# Altium project BTF16_2.PrjPcb (part 2 of 2)

## Sheet ASIC_3.SchDoc: Title
size A2; Date: Date; CompanyName: Integrated Micro-Electronics Bulgaria; Organization: Design & Development Department; Address1: Drawing Type; Address2: Address 1; Address3: Address 2; Address4: Address 3; DocumentNumber: 730xxx; Revision: 01; SheetNumber: 1; SheetTotal: 1; PageSetup: Record=PageOptions|CenterHorizontal=True|CenterVertical=True|PrintScale=0.70|XCorrection=1.00|YCorrection=1.00|PrintKind=2|BorderSize=5000000|LeftOffset=0|BottomOffset=0|Orientation=2|PaperLength=1000|PaperWidth=1000|Scale=100|PaperSource=7|PrintQuality=-4|MediaType=1|DitherType=10|PaperKind=A4|PrintScaleMode=1; SheetSize: A3; Time: Time; ModifiedDate: Mod. Date
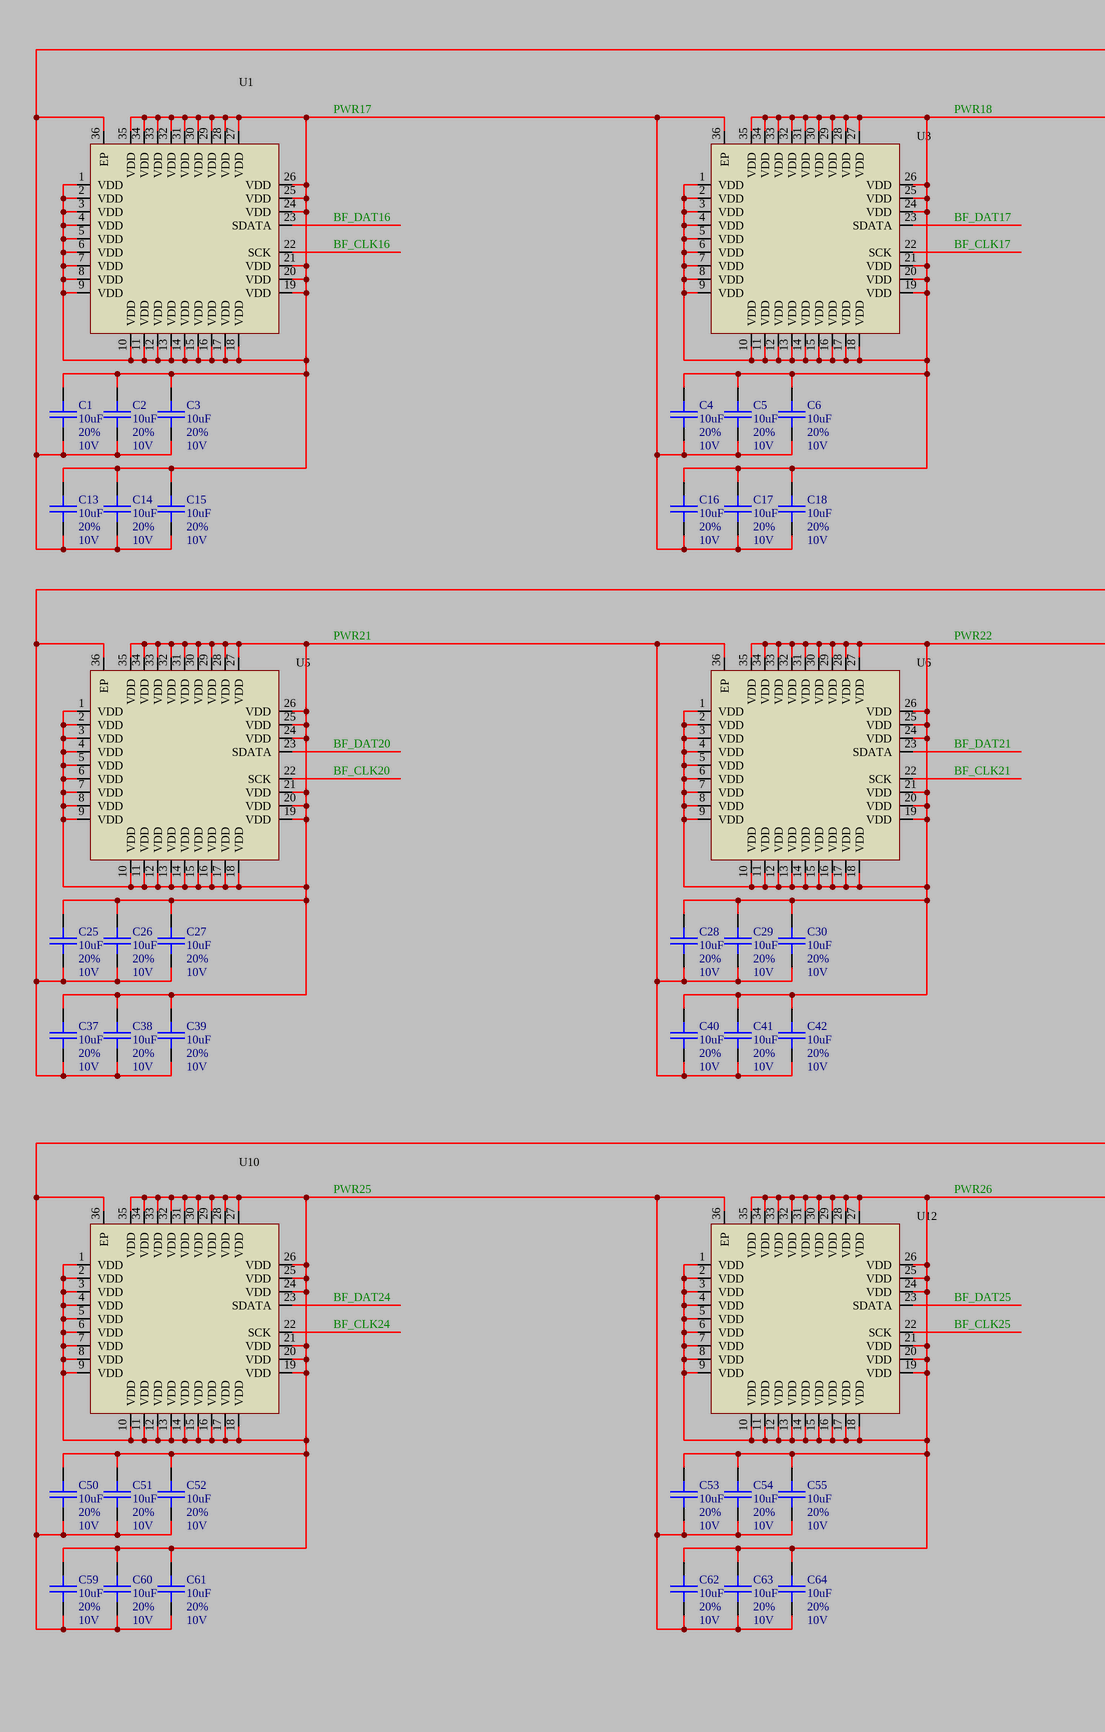
[diagram p6: ASIC_3.SchDoc, left]
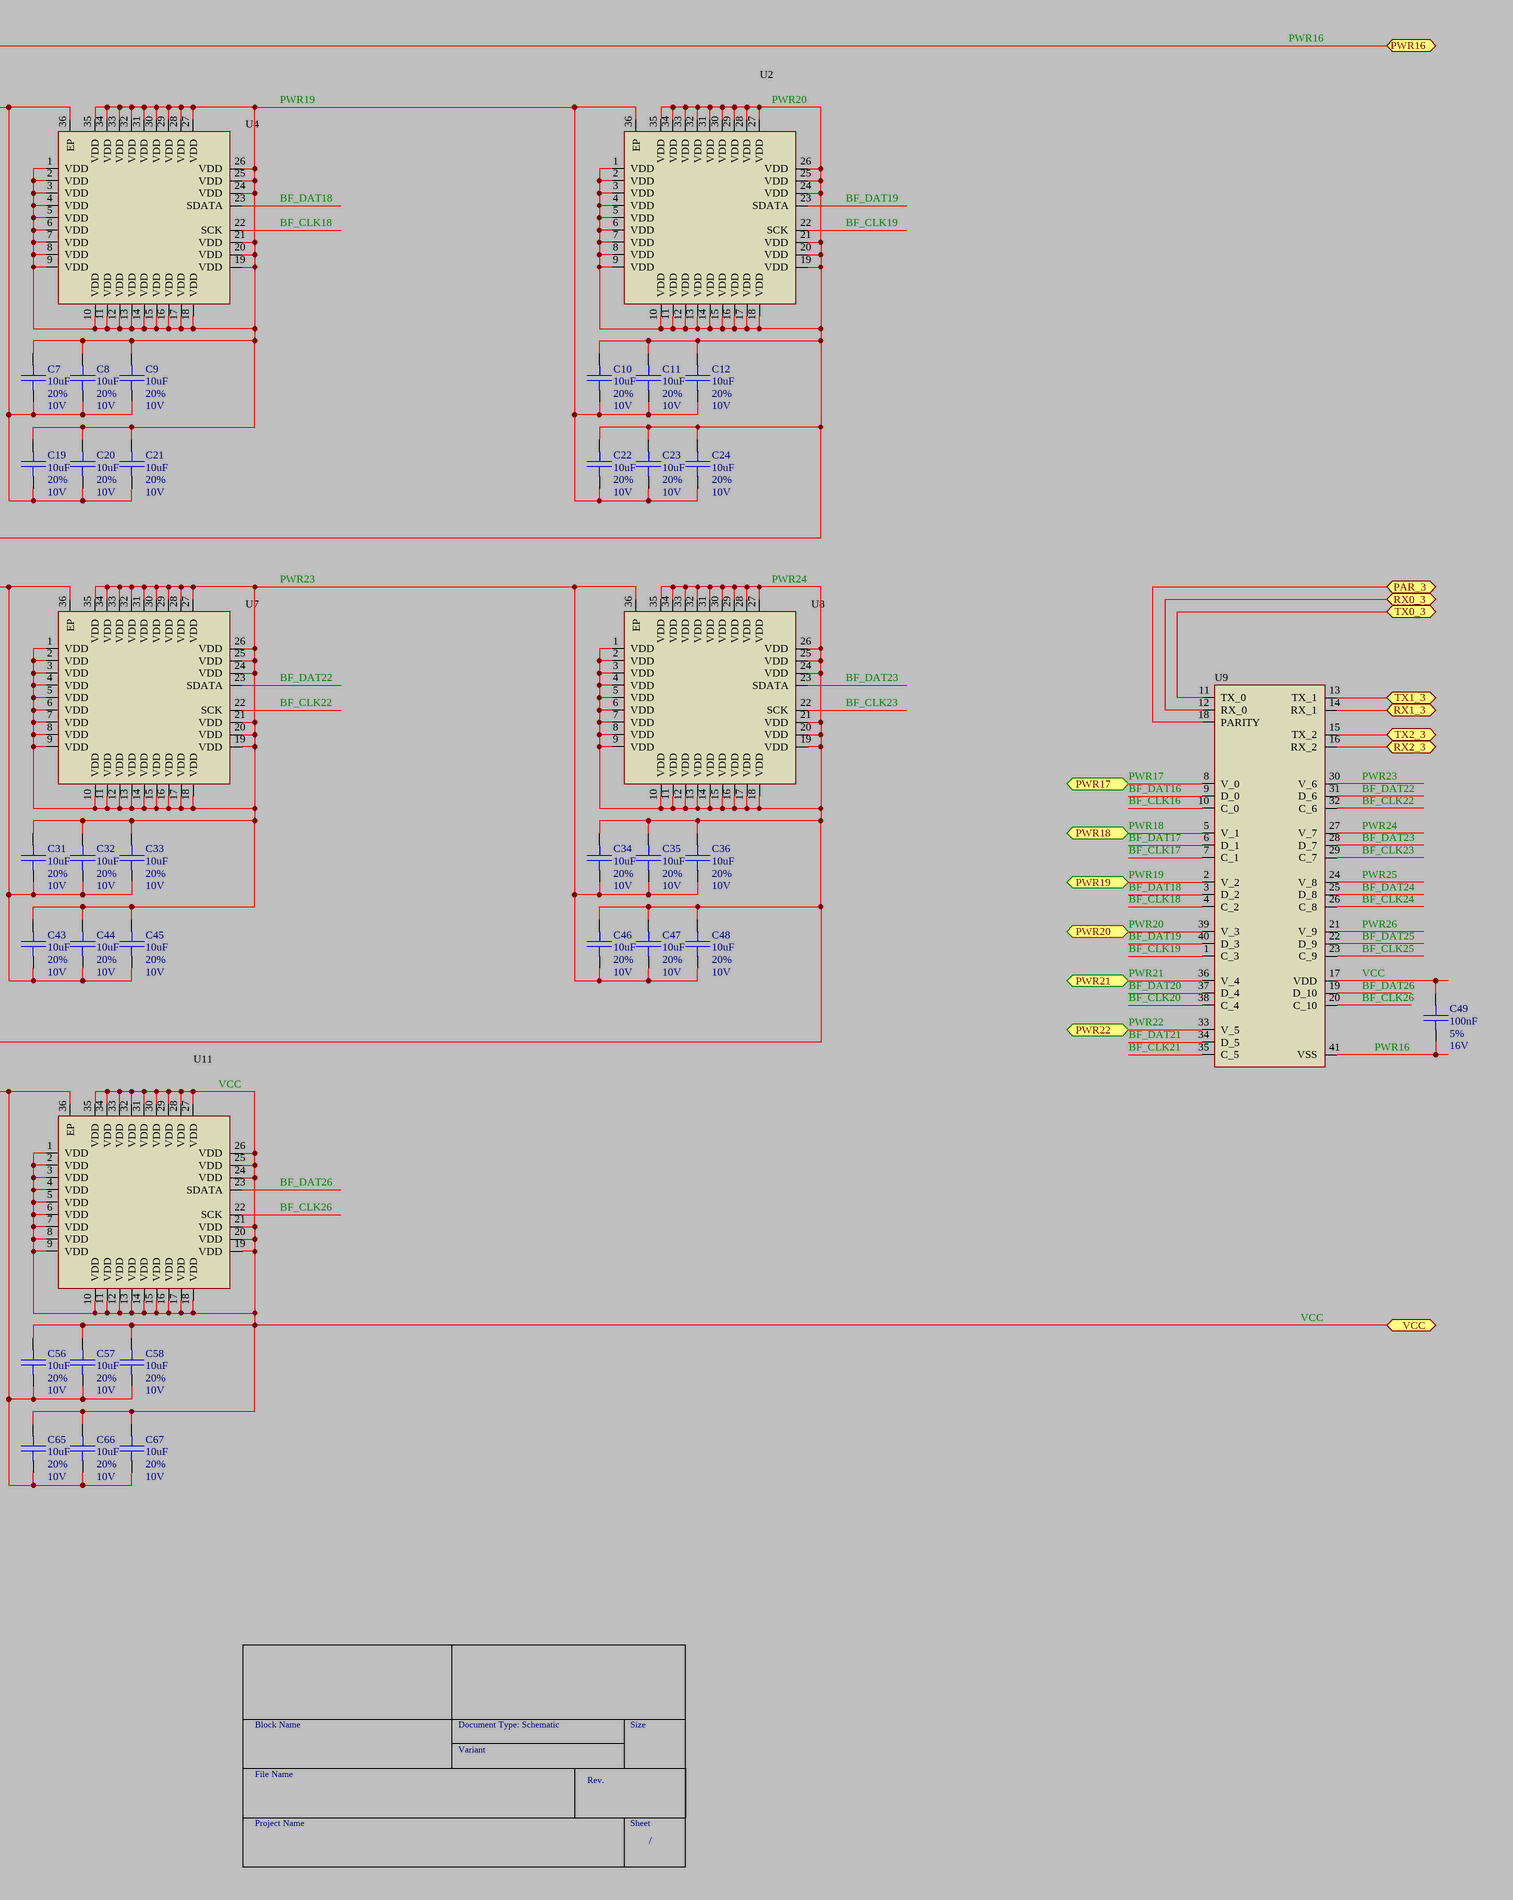
[diagram p7: ASIC_3.SchDoc, right]

### Parts
C1  DB_VALUE: 10uF  DB_TOLERANCE: 20%  DB_VOLTAGE: 10V  [SMD_0402_CAPC1005X70N]  (hidden comment: C)
C2  DB_VALUE: 10uF  DB_TOLERANCE: 20%  DB_VOLTAGE: 10V  [SMD_0402_CAPC1005X70N]  (hidden comment: C)
C3  DB_VALUE: 10uF  DB_TOLERANCE: 20%  DB_VOLTAGE: 10V  [SMD_0402_CAPC1005X70N]  (hidden comment: C)
C4  DB_VALUE: 10uF  DB_TOLERANCE: 20%  DB_VOLTAGE: 10V  [SMD_0402_CAPC1005X70N]  (hidden comment: C)
C5  DB_VALUE: 10uF  DB_TOLERANCE: 20%  DB_VOLTAGE: 10V  [SMD_0402_CAPC1005X70N]  (hidden comment: C)
C6  DB_VALUE: 10uF  DB_TOLERANCE: 20%  DB_VOLTAGE: 10V  [SMD_0402_CAPC1005X70N]  (hidden comment: C)
C7  DB_VALUE: 10uF  DB_TOLERANCE: 20%  DB_VOLTAGE: 10V  [SMD_0402_CAPC1005X70N]  (hidden comment: C)
C8  DB_VALUE: 10uF  DB_TOLERANCE: 20%  DB_VOLTAGE: 10V  [SMD_0402_CAPC1005X70N]  (hidden comment: C)
C9  DB_VALUE: 10uF  DB_TOLERANCE: 20%  DB_VOLTAGE: 10V  [SMD_0402_CAPC1005X70N]  (hidden comment: C)
C10  DB_VALUE: 10uF  DB_TOLERANCE: 20%  DB_VOLTAGE: 10V  [SMD_0402_CAPC1005X70N]  (hidden comment: C)
C11  DB_VALUE: 10uF  DB_TOLERANCE: 20%  DB_VOLTAGE: 10V  [SMD_0402_CAPC1005X70N]  (hidden comment: C)
C12  DB_VALUE: 10uF  DB_TOLERANCE: 20%  DB_VOLTAGE: 10V  [SMD_0402_CAPC1005X70N]  (hidden comment: C)
C13  DB_VALUE: 10uF  DB_TOLERANCE: 20%  DB_VOLTAGE: 10V  [SMD_0402_CAPC1005X70N]  (hidden comment: C)
C14  DB_VALUE: 10uF  DB_TOLERANCE: 20%  DB_VOLTAGE: 10V  [SMD_0402_CAPC1005X70N]  (hidden comment: C)
C15  DB_VALUE: 10uF  DB_TOLERANCE: 20%  DB_VOLTAGE: 10V  [SMD_0402_CAPC1005X70N]  (hidden comment: C)
C16  DB_VALUE: 10uF  DB_TOLERANCE: 20%  DB_VOLTAGE: 10V  [SMD_0402_CAPC1005X70N]  (hidden comment: C)
C17  DB_VALUE: 10uF  DB_TOLERANCE: 20%  DB_VOLTAGE: 10V  [SMD_0402_CAPC1005X70N]  (hidden comment: C)
C18  DB_VALUE: 10uF  DB_TOLERANCE: 20%  DB_VOLTAGE: 10V  [SMD_0402_CAPC1005X70N]  (hidden comment: C)
C19  DB_VALUE: 10uF  DB_TOLERANCE: 20%  DB_VOLTAGE: 10V  [SMD_0402_CAPC1005X70N]  (hidden comment: C)
C20  DB_VALUE: 10uF  DB_TOLERANCE: 20%  DB_VOLTAGE: 10V  [SMD_0402_CAPC1005X70N]  (hidden comment: C)
C21  DB_VALUE: 10uF  DB_TOLERANCE: 20%  DB_VOLTAGE: 10V  [SMD_0402_CAPC1005X70N]  (hidden comment: C)
C22  DB_VALUE: 10uF  DB_TOLERANCE: 20%  DB_VOLTAGE: 10V  [SMD_0402_CAPC1005X70N]  (hidden comment: C)
C23  DB_VALUE: 10uF  DB_TOLERANCE: 20%  DB_VOLTAGE: 10V  [SMD_0402_CAPC1005X70N]  (hidden comment: C)
C24  DB_VALUE: 10uF  DB_TOLERANCE: 20%  DB_VOLTAGE: 10V  [SMD_0402_CAPC1005X70N]  (hidden comment: C)
C25  DB_VALUE: 10uF  DB_TOLERANCE: 20%  DB_VOLTAGE: 10V  [SMD_0402_CAPC1005X70N]  (hidden comment: C)
C26  DB_VALUE: 10uF  DB_TOLERANCE: 20%  DB_VOLTAGE: 10V  [SMD_0402_CAPC1005X70N]  (hidden comment: C)
C27  DB_VALUE: 10uF  DB_TOLERANCE: 20%  DB_VOLTAGE: 10V  [SMD_0402_CAPC1005X70N]  (hidden comment: C)
C28  DB_VALUE: 10uF  DB_TOLERANCE: 20%  DB_VOLTAGE: 10V  [SMD_0402_CAPC1005X70N]  (hidden comment: C)
C29  DB_VALUE: 10uF  DB_TOLERANCE: 20%  DB_VOLTAGE: 10V  [SMD_0402_CAPC1005X70N]  (hidden comment: C)
C30  DB_VALUE: 10uF  DB_TOLERANCE: 20%  DB_VOLTAGE: 10V  [SMD_0402_CAPC1005X70N]  (hidden comment: C)
C31  DB_VALUE: 10uF  DB_TOLERANCE: 20%  DB_VOLTAGE: 10V  [SMD_0402_CAPC1005X70N]  (hidden comment: C)
C32  DB_VALUE: 10uF  DB_TOLERANCE: 20%  DB_VOLTAGE: 10V  [SMD_0402_CAPC1005X70N]  (hidden comment: C)
C33  DB_VALUE: 10uF  DB_TOLERANCE: 20%  DB_VOLTAGE: 10V  [SMD_0402_CAPC1005X70N]  (hidden comment: C)
C34  DB_VALUE: 10uF  DB_TOLERANCE: 20%  DB_VOLTAGE: 10V  [SMD_0402_CAPC1005X70N]  (hidden comment: C)
C35  DB_VALUE: 10uF  DB_TOLERANCE: 20%  DB_VOLTAGE: 10V  [SMD_0402_CAPC1005X70N]  (hidden comment: C)
C36  DB_VALUE: 10uF  DB_TOLERANCE: 20%  DB_VOLTAGE: 10V  [SMD_0402_CAPC1005X70N]  (hidden comment: C)
C37  DB_VALUE: 10uF  DB_TOLERANCE: 20%  DB_VOLTAGE: 10V  [SMD_0402_CAPC1005X70N]  (hidden comment: C)
C38  DB_VALUE: 10uF  DB_TOLERANCE: 20%  DB_VOLTAGE: 10V  [SMD_0402_CAPC1005X70N]  (hidden comment: C)
C39  DB_VALUE: 10uF  DB_TOLERANCE: 20%  DB_VOLTAGE: 10V  [SMD_0402_CAPC1005X70N]  (hidden comment: C)
C40  DB_VALUE: 10uF  DB_TOLERANCE: 20%  DB_VOLTAGE: 10V  [SMD_0402_CAPC1005X70N]  (hidden comment: C)
C41  DB_VALUE: 10uF  DB_TOLERANCE: 20%  DB_VOLTAGE: 10V  [SMD_0402_CAPC1005X70N]  (hidden comment: C)
C42  DB_VALUE: 10uF  DB_TOLERANCE: 20%  DB_VOLTAGE: 10V  [SMD_0402_CAPC1005X70N]  (hidden comment: C)
C43  DB_VALUE: 10uF  DB_TOLERANCE: 20%  DB_VOLTAGE: 10V  [SMD_0402_CAPC1005X70N]  (hidden comment: C)
C44  DB_VALUE: 10uF  DB_TOLERANCE: 20%  DB_VOLTAGE: 10V  [SMD_0402_CAPC1005X70N]  (hidden comment: C)
C45  DB_VALUE: 10uF  DB_TOLERANCE: 20%  DB_VOLTAGE: 10V  [SMD_0402_CAPC1005X70N]  (hidden comment: C)
C46  DB_VALUE: 10uF  DB_TOLERANCE: 20%  DB_VOLTAGE: 10V  [SMD_0402_CAPC1005X70N]  (hidden comment: C)
C47  DB_VALUE: 10uF  DB_TOLERANCE: 20%  DB_VOLTAGE: 10V  [SMD_0402_CAPC1005X70N]  (hidden comment: C)
C48  DB_VALUE: 10uF  DB_TOLERANCE: 20%  DB_VOLTAGE: 10V  [SMD_0402_CAPC1005X70N]  (hidden comment: C)
C49  DB_VALUE: 100nF  DB_TOLERANCE: 5%  DB_VOLTAGE: 16V  [SMD_0603_CAPC1608X95N]  (hidden comment: C)
C50  DB_VALUE: 10uF  DB_TOLERANCE: 20%  DB_VOLTAGE: 10V  [SMD_0402_CAPC1005X70N]  (hidden comment: C)
C51  DB_VALUE: 10uF  DB_TOLERANCE: 20%  DB_VOLTAGE: 10V  [SMD_0402_CAPC1005X70N]  (hidden comment: C)
C52  DB_VALUE: 10uF  DB_TOLERANCE: 20%  DB_VOLTAGE: 10V  [SMD_0402_CAPC1005X70N]  (hidden comment: C)
C53  DB_VALUE: 10uF  DB_TOLERANCE: 20%  DB_VOLTAGE: 10V  [SMD_0402_CAPC1005X70N]  (hidden comment: C)
C54  DB_VALUE: 10uF  DB_TOLERANCE: 20%  DB_VOLTAGE: 10V  [SMD_0402_CAPC1005X70N]  (hidden comment: C)
C55  DB_VALUE: 10uF  DB_TOLERANCE: 20%  DB_VOLTAGE: 10V  [SMD_0402_CAPC1005X70N]  (hidden comment: C)
C56  DB_VALUE: 10uF  DB_TOLERANCE: 20%  DB_VOLTAGE: 10V  [SMD_0402_CAPC1005X70N]  (hidden comment: C)
C57  DB_VALUE: 10uF  DB_TOLERANCE: 20%  DB_VOLTAGE: 10V  [SMD_0402_CAPC1005X70N]  (hidden comment: C)
C58  DB_VALUE: 10uF  DB_TOLERANCE: 20%  DB_VOLTAGE: 10V  [SMD_0402_CAPC1005X70N]  (hidden comment: C)
C59  DB_VALUE: 10uF  DB_TOLERANCE: 20%  DB_VOLTAGE: 10V  [SMD_0402_CAPC1005X70N]  (hidden comment: C)
C60  DB_VALUE: 10uF  DB_TOLERANCE: 20%  DB_VOLTAGE: 10V  [SMD_0402_CAPC1005X70N]  (hidden comment: C)
C61  DB_VALUE: 10uF  DB_TOLERANCE: 20%  DB_VOLTAGE: 10V  [SMD_0402_CAPC1005X70N]  (hidden comment: C)
C62  DB_VALUE: 10uF  DB_TOLERANCE: 20%  DB_VOLTAGE: 10V  [SMD_0402_CAPC1005X70N]  (hidden comment: C)
C63  DB_VALUE: 10uF  DB_TOLERANCE: 20%  DB_VOLTAGE: 10V  [SMD_0402_CAPC1005X70N]  (hidden comment: C)
C64  DB_VALUE: 10uF  DB_TOLERANCE: 20%  DB_VOLTAGE: 10V  [SMD_0402_CAPC1005X70N]  (hidden comment: C)
C65  DB_VALUE: 10uF  DB_TOLERANCE: 20%  DB_VOLTAGE: 10V  [SMD_0402_CAPC1005X70N]  (hidden comment: C)
C66  DB_VALUE: 10uF  DB_TOLERANCE: 20%  DB_VOLTAGE: 10V  [SMD_0402_CAPC1005X70N]  (hidden comment: C)
C67  DB_VALUE: 10uF  DB_TOLERANCE: 20%  DB_VOLTAGE: 10V  [SMD_0402_CAPC1005X70N]  (hidden comment: C)
U1  IC_BITFURY16  [SMD_QFN50P600X600X175-36AN]  (value not drawn)
U2  IC_BITFURY16  [SMD_QFN50P600X600X175-36AN]  (value not drawn)
U3  IC_BITFURY16  [SMD_QFN50P600X600X175-36AN]  (value not drawn)
U4  IC_BITFURY16  [SMD_QFN50P600X600X175-36AN]  (value not drawn)
U5  IC_BITFURY16  [SMD_QFN50P600X600X175-36AN]  (value not drawn)
U6  IC_BITFURY16  [SMD_QFN50P600X600X175-36AN]  (value not drawn)
U7  IC_BITFURY16  [SMD_QFN50P600X600X175-36AN]  (value not drawn)
U8  IC_BITFURY16  [SMD_QFN50P600X600X175-36AN]  (value not drawn)
U9  IC_BTC250  [SMD_QFN40P500X500X80-41N]  (value not drawn)
U10  IC_BITFURY16  [SMD_QFN50P600X600X175-36AN]  (value not drawn)
U11  IC_BITFURY16  [SMD_QFN50P600X600X175-36AN]  (value not drawn)
U12  IC_BITFURY16  [SMD_QFN50P600X600X175-36AN]  (value not drawn)

### Ports
PAR_3, PWR16, PWR17, PWR18, PWR19, PWR20, PWR21, PWR22, RX0_3, RX1_3, RX2_3, TX0_3, TX1_3, TX2_3, VCC

### Nets
BF_CLK16: U1.22(SCK) U9.10(C_0)
BF_CLK17: U3.22(SCK) U9.7(C_1)
BF_CLK18: U4.22(SCK) U9.4(C_2)
BF_CLK19: U2.22(SCK) U9.1(C_3)
BF_CLK20: U5.22(SCK) U9.38(C_4)
BF_CLK21: U6.22(SCK) U9.35(C_5)
BF_CLK22: U7.22(SCK) U9.32(C_6)
BF_CLK23: U8.22(SCK) U9.29(C_7)
BF_CLK24: U9.26(C_8) U10.22(SCK)
BF_CLK25: U9.23(C_9) U12.22(SCK)
BF_CLK26: U9.20(C_10) U11.22(SCK)
BF_DAT16: U1.23(SDATA) U9.9(D_0)
BF_DAT17: U3.23(SDATA) U9.6(D_1)
BF_DAT18: U4.23(SDATA) U9.3(D_2)
BF_DAT19: U2.23(SDATA) U9.40(D_3)
BF_DAT20: U5.23(SDATA) U9.37(D_4)
BF_DAT21: U6.23(SDATA) U9.34(D_5)
BF_DAT22: U7.23(SDATA) U9.31(D_6)
BF_DAT23: U8.23(SDATA) U9.28(D_7)
BF_DAT24: U9.25(D_8) U10.23(SDATA)
BF_DAT25: U9.22(D_9) U12.23(SDATA)
BF_DAT26: U9.19(D_10) U11.23(SDATA)
PAR_3: U9.18(PARITY) ; port PAR_3
PWR16: C1.2 C2.2 C3.2 C13.2 C14.2 C15.2 C49.2 U1.36(EP) U9.41(VSS) ; port PWR16
PWR17: C1.1 C2.1 C3.1 C4.2 C5.2 C6.2 C13.1 C14.1 C15.1 C16.2 C17.2 C18.2 U1.1(VDD) U1.2(VDD) U1.3(VDD) U1.4(VDD) U1.5(VDD) U1.6(VDD) U1.7(VDD) U1.8(VDD) U1.9(VDD) U1.10(VDD) U1.11(VDD) U1.12(VDD) U1.13(VDD) U1.14(VDD) U1.15(VDD) U1.16(VDD) U1.17(VDD) U1.18(VDD) U1.19(VDD) U1.20(VDD) U1.21(VDD) U1.24(VDD) U1.25(VDD) U1.26(VDD) U1.27(VDD) U1.28(VDD) U1.29(VDD) U1.30(VDD) U1.31(VDD) U1.32(VDD) U1.33(VDD) U1.34(VDD) U1.35(VDD) U3.36(EP) U9.8(V_0) ; port PWR17
PWR18: C4.1 C5.1 C6.1 C7.2 C8.2 C9.2 C16.1 C17.1 C18.1 C19.2 C20.2 C21.2 U3.1(VDD) U3.2(VDD) U3.3(VDD) U3.4(VDD) U3.5(VDD) U3.6(VDD) U3.7(VDD) U3.8(VDD) U3.9(VDD) U3.10(VDD) U3.11(VDD) U3.12(VDD) U3.13(VDD) U3.14(VDD) U3.15(VDD) U3.16(VDD) U3.17(VDD) U3.18(VDD) U3.19(VDD) U3.20(VDD) U3.21(VDD) U3.24(VDD) U3.25(VDD) U3.26(VDD) U3.27(VDD) U3.28(VDD) U3.29(VDD) U3.30(VDD) U3.31(VDD) U3.32(VDD) U3.33(VDD) U3.34(VDD) U3.35(VDD) U4.36(EP) U9.5(V_1) ; port PWR18
PWR19: C7.1 C8.1 C9.1 C10.2 C11.2 C12.2 C19.1 C20.1 C21.1 C22.2 C23.2 C24.2 U2.36(EP) U4.1(VDD) U4.2(VDD) U4.3(VDD) U4.4(VDD) U4.5(VDD) U4.6(VDD) U4.7(VDD) U4.8(VDD) U4.9(VDD) U4.10(VDD) U4.11(VDD) U4.12(VDD) U4.13(VDD) U4.14(VDD) U4.15(VDD) U4.16(VDD) U4.17(VDD) U4.18(VDD) U4.19(VDD) U4.20(VDD) U4.21(VDD) U4.24(VDD) U4.25(VDD) U4.26(VDD) U4.27(VDD) U4.28(VDD) U4.29(VDD) U4.30(VDD) U4.31(VDD) U4.32(VDD) U4.33(VDD) U4.34(VDD) U4.35(VDD) U9.2(V_2) ; port PWR19
PWR20: C10.1 C11.1 C12.1 C22.1 C23.1 C24.1 C25.2 C26.2 C27.2 C37.2 C38.2 C39.2 U2.1(VDD) U2.2(VDD) U2.3(VDD) U2.4(VDD) U2.5(VDD) U2.6(VDD) U2.7(VDD) U2.8(VDD) U2.9(VDD) U2.10(VDD) U2.11(VDD) U2.12(VDD) U2.13(VDD) U2.14(VDD) U2.15(VDD) U2.16(VDD) U2.17(VDD) U2.18(VDD) U2.19(VDD) U2.20(VDD) U2.21(VDD) U2.24(VDD) U2.25(VDD) U2.26(VDD) U2.27(VDD) U2.28(VDD) U2.29(VDD) U2.30(VDD) U2.31(VDD) U2.32(VDD) U2.33(VDD) U2.34(VDD) U2.35(VDD) U5.36(EP) U9.39(V_3) ; port PWR20
PWR21: C25.1 C26.1 C27.1 C28.2 C29.2 C30.2 C37.1 C38.1 C39.1 C40.2 C41.2 C42.2 U5.1(VDD) U5.2(VDD) U5.3(VDD) U5.4(VDD) U5.5(VDD) U5.6(VDD) U5.7(VDD) U5.8(VDD) U5.9(VDD) U5.10(VDD) U5.11(VDD) U5.12(VDD) U5.13(VDD) U5.14(VDD) U5.15(VDD) U5.16(VDD) U5.17(VDD) U5.18(VDD) U5.19(VDD) U5.20(VDD) U5.21(VDD) U5.24(VDD) U5.25(VDD) U5.26(VDD) U5.27(VDD) U5.28(VDD) U5.29(VDD) U5.30(VDD) U5.31(VDD) U5.32(VDD) U5.33(VDD) U5.34(VDD) U5.35(VDD) U6.36(EP) U9.36(V_4) ; port PWR21
PWR22: C28.1 C29.1 C30.1 C31.2 C32.2 C33.2 C40.1 C41.1 C42.1 C43.2 C44.2 C45.2 U6.1(VDD) U6.2(VDD) U6.3(VDD) U6.4(VDD) U6.5(VDD) U6.6(VDD) U6.7(VDD) U6.8(VDD) U6.9(VDD) U6.10(VDD) U6.11(VDD) U6.12(VDD) U6.13(VDD) U6.14(VDD) U6.15(VDD) U6.16(VDD) U6.17(VDD) U6.18(VDD) U6.19(VDD) U6.20(VDD) U6.21(VDD) U6.24(VDD) U6.25(VDD) U6.26(VDD) U6.27(VDD) U6.28(VDD) U6.29(VDD) U6.30(VDD) U6.31(VDD) U6.32(VDD) U6.33(VDD) U6.34(VDD) U6.35(VDD) U7.36(EP) U9.33(V_5) ; port PWR22
PWR23: C31.1 C32.1 C33.1 C34.2 C35.2 C36.2 C43.1 C44.1 C45.1 C46.2 C47.2 C48.2 U7.1(VDD) U7.2(VDD) U7.3(VDD) U7.4(VDD) U7.5(VDD) U7.6(VDD) U7.7(VDD) U7.8(VDD) U7.9(VDD) U7.10(VDD) U7.11(VDD) U7.12(VDD) U7.13(VDD) U7.14(VDD) U7.15(VDD) U7.16(VDD) U7.17(VDD) U7.18(VDD) U7.19(VDD) U7.20(VDD) U7.21(VDD) U7.24(VDD) U7.25(VDD) U7.26(VDD) U7.27(VDD) U7.28(VDD) U7.29(VDD) U7.30(VDD) U7.31(VDD) U7.32(VDD) U7.33(VDD) U7.34(VDD) U7.35(VDD) U8.36(EP) U9.30(V_6)
PWR24: C34.1 C35.1 C36.1 C46.1 C47.1 C48.1 C50.2 C51.2 C52.2 C59.2 C60.2 C61.2 U8.1(VDD) U8.2(VDD) U8.3(VDD) U8.4(VDD) U8.5(VDD) U8.6(VDD) U8.7(VDD) U8.8(VDD) U8.9(VDD) U8.10(VDD) U8.11(VDD) U8.12(VDD) U8.13(VDD) U8.14(VDD) U8.15(VDD) U8.16(VDD) U8.17(VDD) U8.18(VDD) U8.19(VDD) U8.20(VDD) U8.21(VDD) U8.24(VDD) U8.25(VDD) U8.26(VDD) U8.27(VDD) U8.28(VDD) U8.29(VDD) U8.30(VDD) U8.31(VDD) U8.32(VDD) U8.33(VDD) U8.34(VDD) U8.35(VDD) U9.27(V_7) U10.36(EP)
PWR25: C50.1 C51.1 C52.1 C53.2 C54.2 C55.2 C59.1 C60.1 C61.1 C62.2 C63.2 C64.2 U9.24(V_8) U10.1(VDD) U10.2(VDD) U10.3(VDD) U10.4(VDD) U10.5(VDD) U10.6(VDD) U10.7(VDD) U10.8(VDD) U10.9(VDD) U10.10(VDD) U10.11(VDD) U10.12(VDD) U10.13(VDD) U10.14(VDD) U10.15(VDD) U10.16(VDD) U10.17(VDD) U10.18(VDD) U10.19(VDD) U10.20(VDD) U10.21(VDD) U10.24(VDD) U10.25(VDD) U10.26(VDD) U10.27(VDD) U10.28(VDD) U10.29(VDD) U10.30(VDD) U10.31(VDD) U10.32(VDD) U10.33(VDD) U10.34(VDD) U10.35(VDD) U12.36(EP)
PWR26: C53.1 C54.1 C55.1 C56.2 C57.2 C58.2 C62.1 C63.1 C64.1 C65.2 C66.2 C67.2 U9.21(V_9) U11.36(EP) U12.1(VDD) U12.2(VDD) U12.3(VDD) U12.4(VDD) U12.5(VDD) U12.6(VDD) U12.7(VDD) U12.8(VDD) U12.9(VDD) U12.10(VDD) U12.11(VDD) U12.12(VDD) U12.13(VDD) U12.14(VDD) U12.15(VDD) U12.16(VDD) U12.17(VDD) U12.18(VDD) U12.19(VDD) U12.20(VDD) U12.21(VDD) U12.24(VDD) U12.25(VDD) U12.26(VDD) U12.27(VDD) U12.28(VDD) U12.29(VDD) U12.30(VDD) U12.31(VDD) U12.32(VDD) U12.33(VDD) U12.34(VDD) U12.35(VDD)
RX0_3: U9.12(RX_0) ; port RX0_3
RX1_3: U9.14(RX_1) ; port RX1_3
RX2_3: U9.16(RX_2) ; port RX2_3
TX0_3: U9.11(TX_0) ; port TX0_3
TX1_3: U9.13(TX_1) ; port TX1_3
TX2_3: U9.15(TX_2) ; port TX2_3
VCC: C49.1 C56.1 C57.1 C58.1 C65.1 C66.1 C67.1 U9.17(VDD) U11.1(VDD) U11.2(VDD) U11.3(VDD) U11.4(VDD) U11.5(VDD) U11.6(VDD) U11.7(VDD) U11.8(VDD) U11.9(VDD) U11.10(VDD) U11.11(VDD) U11.12(VDD) U11.13(VDD) U11.14(VDD) U11.15(VDD) U11.16(VDD) U11.17(VDD) U11.18(VDD) U11.19(VDD) U11.20(VDD) U11.21(VDD) U11.24(VDD) U11.25(VDD) U11.26(VDD) U11.27(VDD) U11.28(VDD) U11.29(VDD) U11.30(VDD) U11.31(VDD) U11.32(VDD) U11.33(VDD) U11.34(VDD) U11.35(VDD) ; port VCC

### Notes on the sheet
- Block Name
- Document Type: Schematic
- Size
- File Name
- Variant
- Rev.
- Project Name
- Sheet
- /

### Library data of the parts
C1-C48 C50-C67 = CAP000047481: DB_PART_TYPE: Ceramic_SMD\Standard_X5R; DB_MANUFACTURER_PART: SAMSUNG    CL05A106MP5NUNC; NOTE: <NOTE>; DB_T_RANGE: -55 to 85; DB_PACKAGE: 0402; DB_DESCRIPTION: C X5R 10uF 20% 10V 0402; DB_APPROVED_BY: VSN; DB_STATUS: NEW; DB_PART_NUMBER: CAP000047481; DB_PCB_DEVICE: SMD_0402_CAPC1005X70N; DB_APPROVED_ON: 20.04.2016 14:32:27; DB_DATASHEET: http://john.epiqdesign.com/projects/CIS_Datasheets/CAP_S_CL05A106MP5NUNC.pdf?rev=2053&sc=0
C49 = CAP000027134: DB_PART_TYPE: Ceramic_SMD\Standard_X7R; DB_MANUFACTURER_PART: KEMET    C0603C104J4RAC; NOTE: <NOTE>; DB_T_RANGE: -55 to 125; DB_PACKAGE: 0603; DB_DESCRIPTION: C X7R 100nF 5% 16V 0603; DB_STATUS: NEW; DB_PART_NUMBER: CAP000027134; DB_PCB_DEVICE: SMD_0603_CAPC1608X95N; DB_APPROVED_ON: 09.10.2010; DB_DATASHEET: http://john.epiqdesign.com/projects/CIS_Datasheets/F3102_CE_Kemet.pdf?rev=92&sc=0
U1-U8 U10-U12 = IC_BITFURY16: BitFury 2016 16 nm; DB_PACKAGE: FCLGA 35L 6x6mm; DB_VALUE: BF8162C16; DB_DESCRIPTION: BitFury 2016 16 nm; DB_PCB_DEVICE: SMD_QFN50P600X600X175-36AN
U9 = IC_BTC250: DB_MANUFACTURER_PART: BTC250 QFN40 EP; DB_PACKAGE: QFN40 EP; DB_VALUE: BTC250; DB_PCB_DEVICE: SMD_QFN40P500X500X80-41N

## Sheet POWER.SchDoc: Title
size A3; Date: Date; CompanyName: Integrated Micro-Electronics Bulgaria; Organization: Design & Development Department; Address1: Drawing Type; Address2: Address 1; Address3: Address 2; Address4: Address 3; DocumentNumber: 730xxx; Revision: 01; SheetNumber: 1; SheetTotal: 1; PageSetup: Record=PageOptions|CenterHorizontal=True|CenterVertical=True|PrintScale=0.70|XCorrection=1.00|YCorrection=1.00|PrintKind=2|BorderSize=5000000|LeftOffset=0|BottomOffset=0|Orientation=2|PaperLength=1000|PaperWidth=1000|Scale=100|PaperSource=7|PrintQuality=-4|MediaType=1|DitherType=10|PaperKind=A4|PrintScaleMode=1; SheetSize: A3; Time: Time; ModifiedDate: Mod. Date
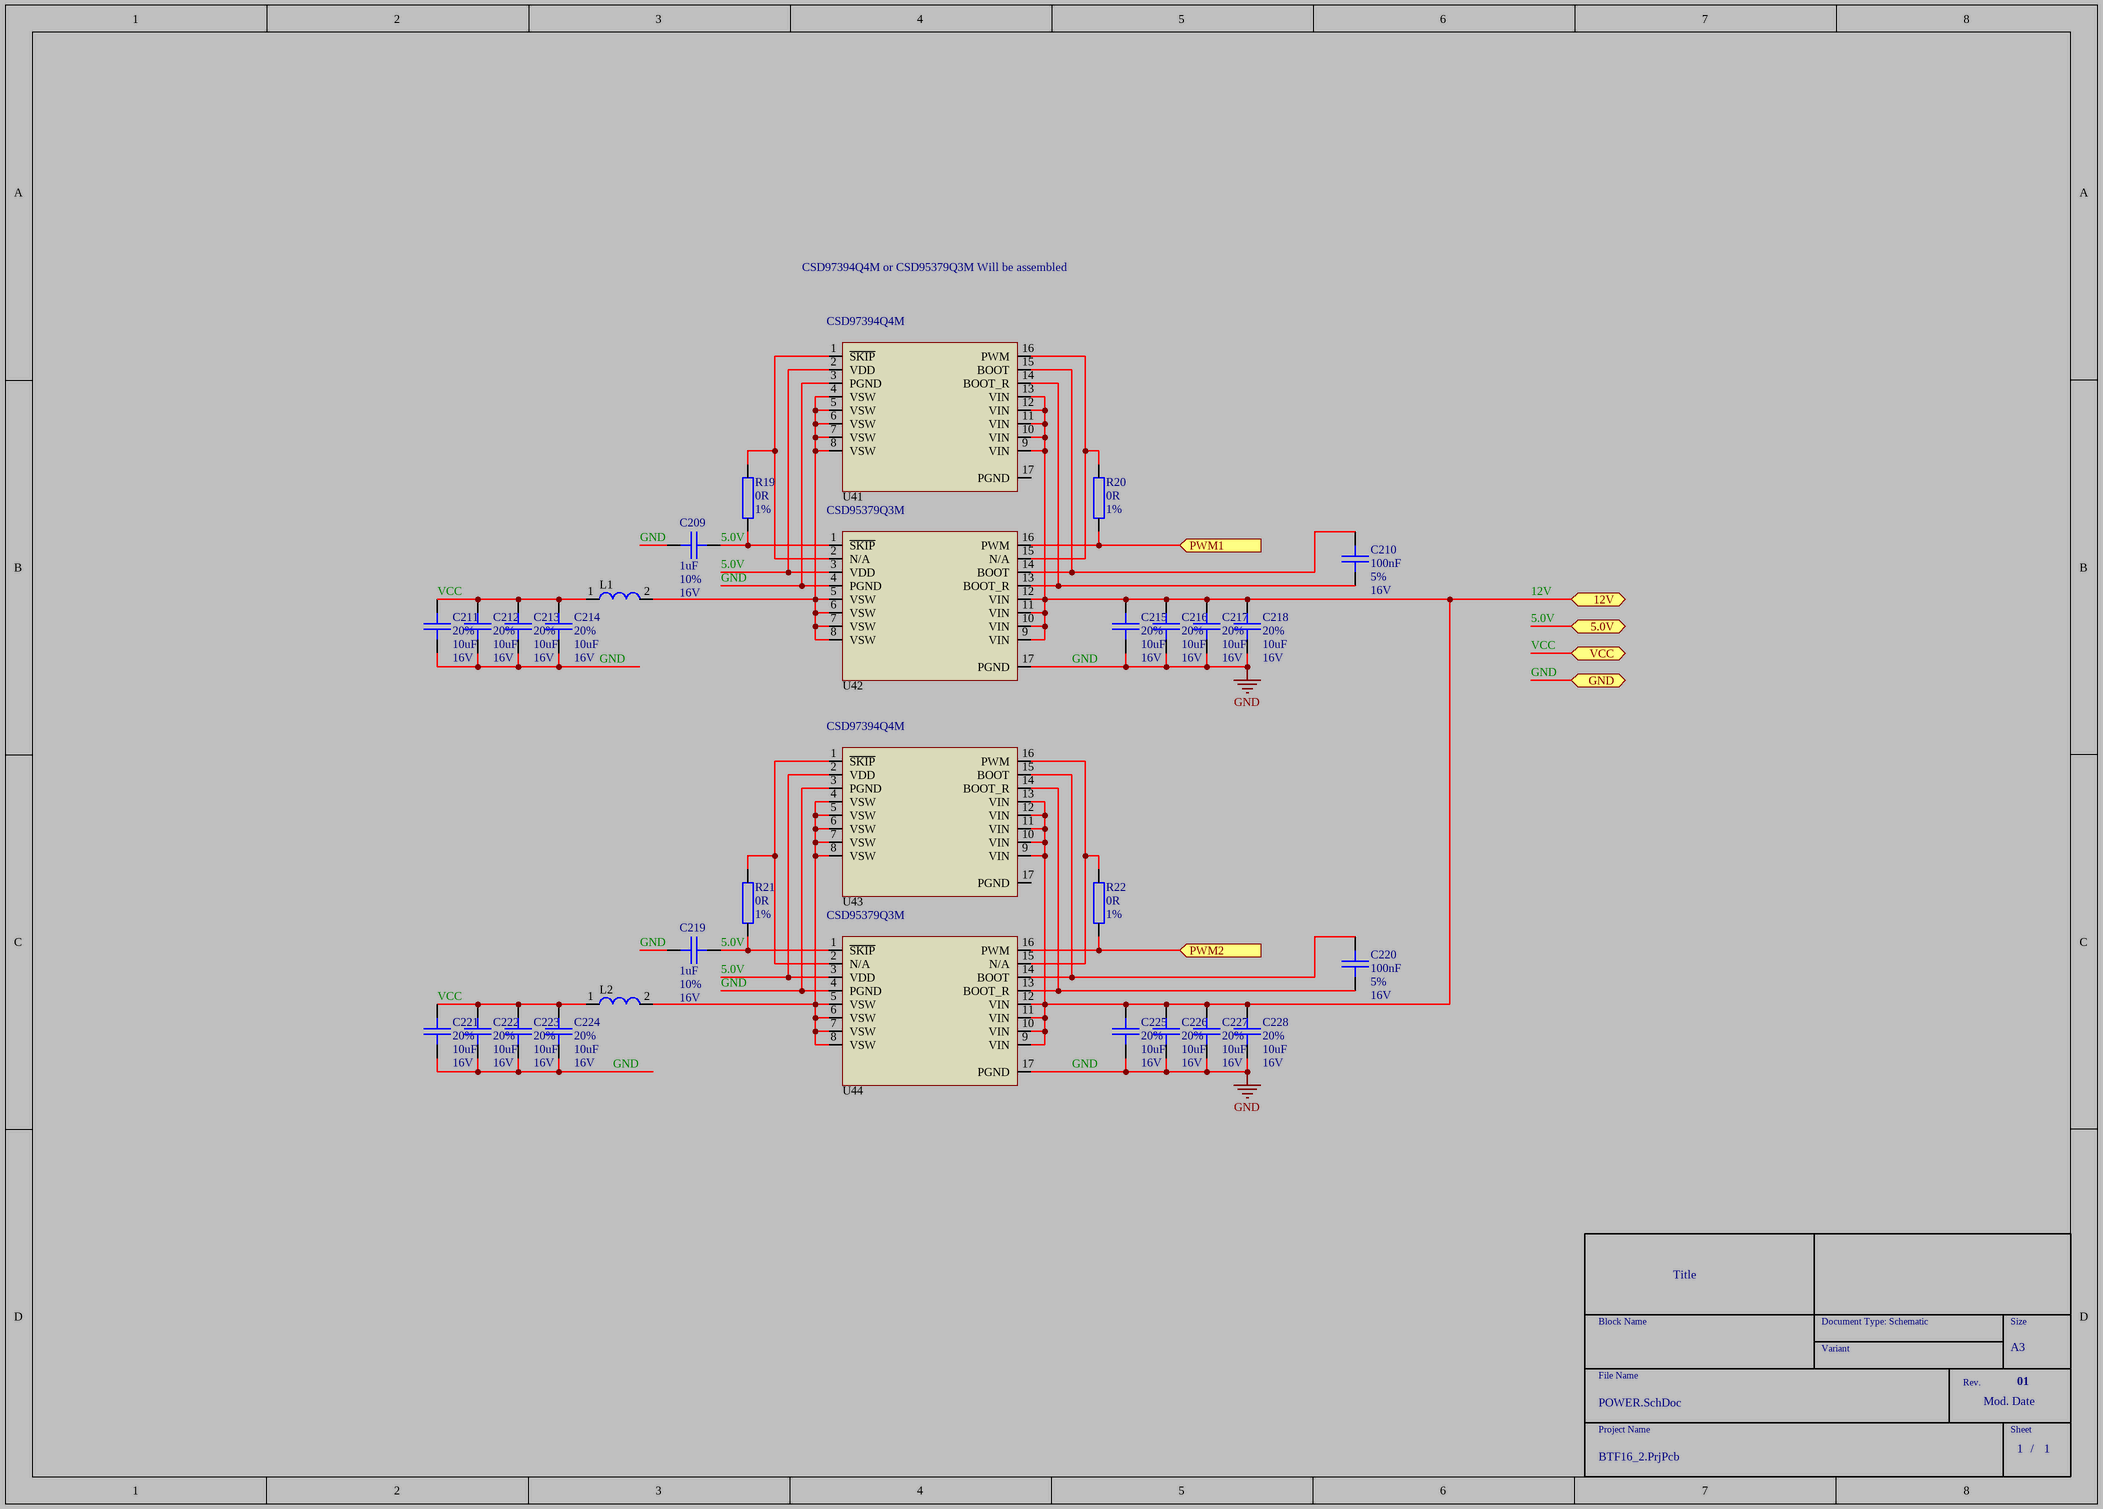
[diagram p8: POWER.SchDoc]

### Parts
C209  DB_VALUE: 1uF  DB_TOLERANCE: 10%  DB_VOLTAGE: 16V  [SMD_0603_CAPC1608X95N]  (hidden comment: C)
C210  DB_VALUE: 100nF  DB_TOLERANCE: 5%  DB_VOLTAGE: 16V  [SMD_0603_CAPC1608X95N]  (hidden comment: C)
C211  DB_TOLERANCE: 20%  DB_VALUE: 10uF  DB_VOLTAGE: 16V  [SMD_0805_CAPC2012X145N]  (hidden comment: C)
C212  DB_TOLERANCE: 20%  DB_VALUE: 10uF  DB_VOLTAGE: 16V  [SMD_0805_CAPC2012X145N]  (hidden comment: C)
C213  DB_TOLERANCE: 20%  DB_VALUE: 10uF  DB_VOLTAGE: 16V  [SMD_0805_CAPC2012X145N]  (hidden comment: C)
C214  DB_TOLERANCE: 20%  DB_VALUE: 10uF  DB_VOLTAGE: 16V  [SMD_0805_CAPC2012X145N]  (hidden comment: C)
C215  DB_TOLERANCE: 20%  DB_VALUE: 10uF  DB_VOLTAGE: 16V  [SMD_0805_CAPC2012X145N]  (hidden comment: C)
C216  DB_TOLERANCE: 20%  DB_VALUE: 10uF  DB_VOLTAGE: 16V  [SMD_0805_CAPC2012X145N]  (hidden comment: C)
C217  DB_TOLERANCE: 20%  DB_VALUE: 10uF  DB_VOLTAGE: 16V  [SMD_0805_CAPC2012X145N]  (hidden comment: C)
C218  DB_TOLERANCE: 20%  DB_VALUE: 10uF  DB_VOLTAGE: 16V  [SMD_0805_CAPC2012X145N]  (hidden comment: C)
C219  DB_VALUE: 1uF  DB_TOLERANCE: 10%  DB_VOLTAGE: 16V  [SMD_0603_CAPC1608X95N]  (hidden comment: C)
C220  DB_VALUE: 100nF  DB_TOLERANCE: 5%  DB_VOLTAGE: 16V  [SMD_0603_CAPC1608X95N]  (hidden comment: C)
C221  DB_TOLERANCE: 20%  DB_VALUE: 10uF  DB_VOLTAGE: 16V  [SMD_0805_CAPC2012X145N]  (hidden comment: C)
C222  DB_TOLERANCE: 20%  DB_VALUE: 10uF  DB_VOLTAGE: 16V  [SMD_0805_CAPC2012X145N]  (hidden comment: C)
C223  DB_TOLERANCE: 20%  DB_VALUE: 10uF  DB_VOLTAGE: 16V  [SMD_0805_CAPC2012X145N]  (hidden comment: C)
C224  DB_TOLERANCE: 20%  DB_VALUE: 10uF  DB_VOLTAGE: 16V  [SMD_0805_CAPC2012X145N]  (hidden comment: C)
C225  DB_TOLERANCE: 20%  DB_VALUE: 10uF  DB_VOLTAGE: 16V  [SMD_0805_CAPC2012X145N]  (hidden comment: C)
C226  DB_TOLERANCE: 20%  DB_VALUE: 10uF  DB_VOLTAGE: 16V  [SMD_0805_CAPC2012X145N]  (hidden comment: C)
C227  DB_TOLERANCE: 20%  DB_VALUE: 10uF  DB_VOLTAGE: 16V  [SMD_0805_CAPC2012X145N]  (hidden comment: C)
C228  DB_TOLERANCE: 20%  DB_VALUE: 10uF  DB_VOLTAGE: 16V  [SMD_0805_CAPC2012X145N]  (hidden comment: C)
L1  470nH  [SMT_INDM135130X800N]  (value not drawn)
L2  470nH  [SMT_INDM135130X800N]  (value not drawn)
R19  DB_VALUE: 0R  DB_TOLERANCE: 1%  [SMD_0603_RESC1608X55N]  (hidden comment: R)
R20  DB_VALUE: 0R  DB_TOLERANCE: 1%  [SMD_0603_RESC1608X55N]  (hidden comment: R)
R21  DB_VALUE: 0R  DB_TOLERANCE: 1%  [SMD_0603_RESC1608X55N]  (hidden comment: R)
R22  DB_VALUE: 0R  DB_TOLERANCE: 1%  [SMD_0603_RESC1608X55N]  (hidden comment: R)
U41  DB_VALUE: CSD97394Q4M  [SMD_SON40P330X330X100-17N]  (hidden comment: CSD95379Q3M)
U42  CSD95379Q3M  [SMD_SON40P330X330X100-17N]
U43  DB_VALUE: CSD97394Q4M  [SMD_SON40P330X330X100-17N]  (hidden comment: CSD95379Q3M)
U44  CSD95379Q3M  [SMD_SON40P330X330X100-17N]

### Ports
5.0V, 12V, GND, PWM1 (in), PWM2 (in), VCC

### Nets
GND: C209.2 C211.2 C212.2 C213.2 C214.2 C215.2 C216.2 C217.2 C218.2 C219.2 C221.2 C222.2 C223.2 C224.2 C225.2 C226.2 C227.2 C228.2 U41.3(PGND) U42.4(PGND) U42.17(PGND) U43.3(PGND) U44.4(PGND) U44.17(PGND) ; port GND
5.0V: C209.1 C219.1 R19.1 R21.1 U41.2(VDD) U42.1(~{SKIP}) U42.3(VDD) U43.2(VDD) U44.1(~{SKIP}) U44.3(VDD) ; port 5.0V
12V: C215.1 C216.1 C217.1 C218.1 C225.1 C226.1 C227.1 C228.1 U41.9(VIN) U41.10(VIN) U41.11(VIN) U41.12(VIN) U41.13(VIN) U42.9(VIN) U42.10(VIN) U42.11(VIN) U42.12(VIN) U43.9(VIN) U43.10(VIN) U43.11(VIN) U43.12(VIN) U43.13(VIN) U44.9(VIN) U44.10(VIN) U44.11(VIN) U44.12(VIN) ; port 12V
PWM1: R20.1 U42.16(PWM) ; port PWM1
PWM2: R22.1 U44.16(PWM) ; port PWM2
VCC: C211.1 C212.1 C213.1 C214.1 C221.1 C222.1 C223.1 C224.1 L1.1 L2.1 ; port VCC
NetC210_1: C210.1 U41.15(BOOT) U42.14(BOOT)
NetC210_2: C210.2 U41.14(BOOT_R) U42.13(BOOT_R)
NetC220_1: C220.1 U43.15(BOOT) U44.14(BOOT)
NetC220_2: C220.2 U43.14(BOOT_R) U44.13(BOOT_R)
NetL1_2: L1.2 U41.4(VSW) U41.5(VSW) U41.6(VSW) U41.7(VSW) U41.8(VSW) U42.5(VSW) U42.6(VSW) U42.7(VSW) U42.8(VSW)
NetL2_2: L2.2 U43.4(VSW) U43.5(VSW) U43.6(VSW) U43.7(VSW) U43.8(VSW) U44.5(VSW) U44.6(VSW) U44.7(VSW) U44.8(VSW)
NetR19_2: R19.2 U41.1(~{SKIP}) U42.2(N/A)
NetR20_2: R20.2 U41.16(PWM) U42.15(N/A)
NetR21_2: R21.2 U43.1(~{SKIP}) U44.2(N/A)
NetR22_2: R22.2 U43.16(PWM) U44.15(N/A)

Not connected (* = marked no-connect by the designer): U41 17(PGND); U43 17(PGND)

### Notes on the sheet
- CSD97394Q4M or CSD95379Q3M Will be assembled
- Block Name
- Document Type: Schematic
- Size
- File Name
- Variant
- Rev.
- Project Name
- Sheet
- /

### Library data of the parts
C209 C219 = CAP000023307: DB_PART_TYPE: Ceramic_SMD\Open_Mode_X7R; DB_MANUFACTURER_PART: KEMET    C0603F105K4RAC; NOTE: <NOTE>; DB_T_RANGE: -55 to 125; DB_PACKAGE: 0603; DB_DESCRIPTION: C X7R 1uF 10% 16V 0603; DB_STATUS: NEW; DB_PART_NUMBER: CAP000023307; DB_PCB_DEVICE: SMD_0603_CAPC1608X95N; DB_APPROVED_ON: 09.10.2010; DB_DATASHEET: http://john.epiqdesign.com/projects/CIS_Datasheets/F3102_CE_Kemet.pdf?rev=92&sc=0
C210 C220 = CAP000027134: as C49 on sheet ASIC_3; DB_PART_NUMBER: CAP000027134; DB_PCB_DEVICE: SMD_0603_CAPC1608X95N; DB_APPROVED_ON: 09.10.2010; DB_DATASHEET: http://john.epiqdesign.com/projects/CIS_Datasheets/F3102_CE_Kemet.pdf?rev=92&sc=0
C211-C218 C221-C228 = CAP000043650: DB_MANUFACTURER_PART: KEMET    C0805C106M4PAC; DB_PART_TYPE: Ceramic_SMD\Standard_X5R; NOTE: <NOTE>; DB_DESCRIPTION: C X5R 10uF 20% 16V 0805; DB_PACKAGE: 0805; DB_STATUS: NEW; DB_T_RANGE: -55 to 85; DB_APPROVED_ON: 09.10.2010; DB_DATASHEET: http://john.epiqdesign.com/projects/CIS_Datasheets/F3102_CE_Kemet.pdf?rev=92&sc=0; DB_PART_NUMBER: CAP000043650; DB_PCB_DEVICE: SMD_0805_CAPC2012X145N
L1 L2 = L: DB_PCB_DEVICE: SMT_INDM135130X800N
R19-R22 = RES000008926: DB_PART_TYPE: SMD; DB_MANUFACTURER_PART: YAGEO    AC0603FR-070RL; NOTE: <NOTE>; DB_T_RANGE: -55 to 155; DB_POWER: 1/10W; DB_PACKAGE: 0603; DB_DESCRIPTION: R SMD 0R 1% 1/10W 0603; DB_CERTIFIED: AUT; DB_APPROVED_BY: VSN; DB_STATUS: NEW; R_BDS: R; DB_PART_NUMBER: RES000008926; DB_PCB_DEVICE: SMD_0603_RESC1608X55N; DB_APPROVED_ON: 21.05.2013 09:19:53; DB_DATASHEET: http://john.epiqdesign.com/projects/CIS_Datasheets/RES_AC_YAGEO.pdf?rev=263&sc=0
U41 U43 = IC_CSD97394Q4M: Texas Instrumendts Buck Boost DC-DC; DB_MANUFACTURER_PART: TEXAS INSTRUMENTS  CSD97394Q4M; DB_DESCRIPTION: IC CSD97394Q4M VSON-CLIP-10 EP; DB_PACKAGE: VSON-CLIP-10 EP; DB_PCB_DEVICE: SMD_SON40P330X330X100-17N
U42 U44 = IC_CSD95379Q3M: Texas Instrumendts Buck Boost DC-DC; DB_MANUFACTURER_PART: TEXAS INSTRUMENTS  CSD95379Q3M; DB_DESCRIPTION: IC CSD95379Q3M VSON-CLIP-10 EP; DB_PACKAGE: VSON-CLIP-10 EP; DB_PCB_DEVICE: SMD_SON40P330X330X100-17N; DB_VALUE: CSD95379Q3M

## Nets that join several sheets
GND: Block (6 pins), MCU (33 pins), POWER (24 pins)
5.0V: MCU (10 pins), POWER (10 pins)
12V: MCU (11 pins), POWER (26 pins)
CLK_PAR: MCU (R17.2), ASIC_1 (U21.18)
MISO_TX0: MCU (R16.2), ASIC_1 (U21.11)
MOSI_RX0: MCU (R15.2), ASIC_1 (U21.12)
PAR_2: Block (R8.1), ASIC_2 (U33.18)
PAR_3: Block (R3.1), ASIC_3 (U9.18)
POWER_ON_OFF: Block (Q1.4 Q2.4), MCU (R18.2)
PWM1: MCU (U37.5 U38.5), POWER (R20.1 U42.16)
PWM2: MCU (U37.8), POWER (R22.1 U44.16)
PWR0: Block (8 pins), ASIC_1 (9 pins)
PWR11: Block (R8.2 R9.2 R10.2), ASIC_1 (41 pins), ASIC_2 (9 pins)
PWR16: Block (R3.2 R4.2 R5.2), ASIC_2 (41 pins), ASIC_3 (9 pins)
PWR17: ASIC_2 (U33.31 U33.33), ASIC_3 (47 pins)
PWR18: ASIC_2 (U33.28 U33.30), ASIC_3 (47 pins)
PWR19: ASIC_2 (U33.25 U33.27), ASIC_3 (47 pins)
PWR20: ASIC_2 (U33.22 U33.24), ASIC_3 (47 pins)
PWR21: ASIC_2 (U33.19 U33.21), ASIC_3 (47 pins)
PWR22: Block (R6.2 R7.2), ASIC_2 (C187.1 U33.17), ASIC_3 (47 pins)
RX0_2: Block (C70.1), ASIC_2 (U33.12)
RX0_3: Block (C68.1), ASIC_3 (U9.12)
RX1_1: Block (C69.2), ASIC_1 (U21.14)
RX1_2: Block (R7.1 R10.1), ASIC_2 (U33.14)
RX1_3: Block (R2.1 R5.1), ASIC_3 (U9.14)
RX2_1: Block (C71.2), ASIC_1 (U21.16)
RX2_2: Block (R6.1 R9.1), ASIC_2 (U33.16)
RX2_3: Block (R1.1 R4.1), ASIC_3 (U9.16)
TX0_2: Block (C71.1), ASIC_2 (U33.11)
TX0_3: Block (C69.1), ASIC_3 (U9.11)
TX1_1: Block (C68.2), ASIC_1 (U21.13)
TX1_2: Block (TP3.1), ASIC_2 (U33.13)
TX1_3: Block (TP1.1), ASIC_3 (U9.13)
TX2_1: Block (C70.2), ASIC_1 (U21.15)
TX2_2: Block (TP4.1), ASIC_2 (U33.15)
TX2_3: Block (TP2.1), ASIC_3 (U9.15)
VCC: Block (R1.2 R2.2), MCU (R11.1), ASIC_3 (41 pins), POWER (10 pins)